# Altium schematic sheet LED_multiplexing.SchDoc
size A
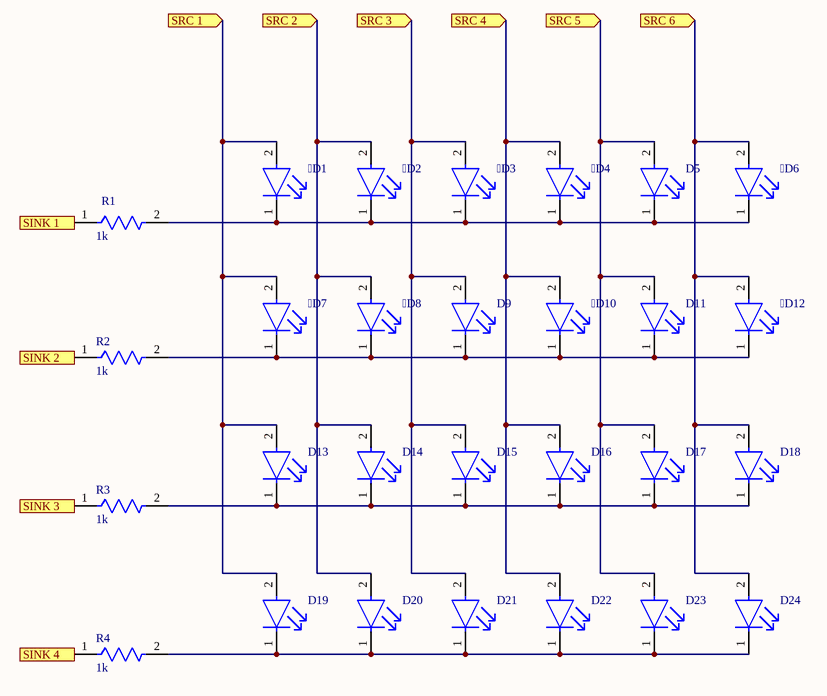
[diagram p0: LED_multiplexing.SchDoc]

## Parts
D1  (no value)  [FP-SML-P11MTT86-MFG]
D2  (no value)  [FP-SML-P11MTT86-MFG]
D3  (no value)  [FP-SML-P11MTT86-MFG]
D4  (no value)  [FP-SML-P11MTT86-MFG]
D6  (no value)  [FP-SML-P11MTT86-MFG]
D7  (no value)  [FP-SML-P11MTT86-MFG]
D8  (no value)  [FP-SML-P11MTT86-MFG]
D10  (no value)  [FP-SML-P11MTT86-MFG]
D12  (no value)  [FP-SML-P11MTT86-MFG]
D5  (no value)  [FP-SML-P11MTT86-MFG]
D9  (no value)  [FP-SML-P11MTT86-MFG]
D11  (no value)  [FP-SML-P11MTT86-MFG]
D13  (no value)  [FP-SML-P11MTT86-MFG]
D14  (no value)  [FP-SML-P11MTT86-MFG]
D15  (no value)  [FP-SML-P11MTT86-MFG]
D16  (no value)  [FP-SML-P11MTT86-MFG]
D17  (no value)  [FP-SML-P11MTT86-MFG]
D18  (no value)  [FP-SML-P11MTT86-MFG]
D19  (no value)  [FP-SML-P11MTT86-MFG]
D20  (no value)  [FP-SML-P11MTT86-MFG]
D21  (no value)  [FP-SML-P11MTT86-MFG]
D22  (no value)  [FP-SML-P11MTT86-MFG]
D23  (no value)  [FP-SML-P11MTT86-MFG]
D24  (no value)  [FP-SML-P11MTT86-MFG]
R1  1k  [FP-CRCW0402-e3-IPC_C]
R2  1k  [FP-CRCW0402-e3-IPC_C]
R3  1k  [FP-CRCW0402-e3-IPC_C]
R4  1k  [FP-CRCW0402-e3-IPC_C]

## Ports
SINK 1 (in), SINK 2 (in), SINK 3 (in), SINK 4 (in), SRC 1 (in), SRC 2 (in), SRC 3 (in), SRC 4 (in), SRC 5 (in), SRC 6 (in)

## Nets
SINK 1: R1.1 ; port SINK 1
SINK 2: R2.1 ; port SINK 2
SINK 3: R3.1 ; port SINK 3
SINK 4: R4.1 ; port SINK 4
SRC 1: D1.2(A) D7.2(A) D13.2(A) D19.2(A) ; port SRC 1
SRC 2: D2.2(A) D8.2(A) D14.2(A) D20.2(A) ; port SRC 2
SRC 3: D3.2(A) D9.2(A) D15.2(A) D21.2(A) ; port SRC 3
SRC 4: D4.2(A) D10.2(A) D16.2(A) D22.2(A) ; port SRC 4
SRC 5: D5.2(A) D11.2(A) D17.2(A) D23.2(A) ; port SRC 5
SRC 6: D6.2(A) D12.2(A) D18.2(A) D24.2(A) ; port SRC 6
NetD1_1: D1.1(C) D2.1(C) D3.1(C) D4.1(C) D6.1(C) D5.1(C) R1.2
NetD7_1: D7.1(C) D8.1(C) D10.1(C) D12.1(C) D9.1(C) D11.1(C) R2.2
NetD13_1: D13.1(C) D14.1(C) D15.1(C) D16.1(C) D17.1(C) D18.1(C) R3.2
NetD19_1: D19.1(C) D20.1(C) D21.1(C) D22.1(C) D23.1(C) D24.1(C) R4.2

## Library data of the parts
D1-D4 D6-D8 D10 D12 D5 D9 D11 D13-D24 = CMP-2000-07126-2: LED YELLOW/GREEN CLEAR 1006 SMD; Forward Current: 20mA; Lens Color: Colorless; Power Rating: 54mW; Lens Style: Diffused; Wavelength: 569nm; Viewing Angle: 150°; Number of LEDs: 1; Test Current: 1mA; Luminous Intensity: 2.1mcd; Illumination Color: Green; Forward Voltage: 1.9V; REACH SVHC: No SVHC; Mount: Surface Mount; Series: PicoLED™; Case Code (Imperial): 0402; Min Operating Temperature: -40°C; Max Operating Temperature: 85°C; Number of Pins: 2; Package Quantity: 1; Height: 0.25mm; Lens Transparency: Clear; Case Code (Metric): 1005; Packaging: Tape and Reel; Width: 0.6mm; Radiation Hardening: No; Case/Package: 0402; Lead Free: Lead Free; Color: Green; RoHS Compliant: Yes; Length: 1mm; Dominant Wavelength: 569nm
R1-R4 = CMP-2002-08122-2: RES Thick Film, 0Ω, 0.063W, 0402; Tolerance: 5%; Max Power Dissipation: 63mW; Voltage Rating: 50V; Temperature Coefficient: 100ppm/°C; Resistance: 0mR; Contact Plating: Tin; Height: 0.35mm; Radiation Hardening: No; Features: Automotive AEC-Q200; Composition: Thick Film; Width: 0.5mm; Weight: 2.3E-05oz; Termination: SMD/SMT; Packaging: Tape and Reel; Mount: Surface Mount; Case Code (Metric): 1005; Military Standard: Not; Min Operating Temperature: -55°C; Number of Terminations: 2; Package Quantity: 1; Case Code (Imperial): 0402; Depth: 0.5mm; Max Operating Temperature: 155°C; Case/Package: 0402; Power Rating: 63mW; Lead Free: Lead Free; Voltage Rating (DC): 50V; Length: 1mm